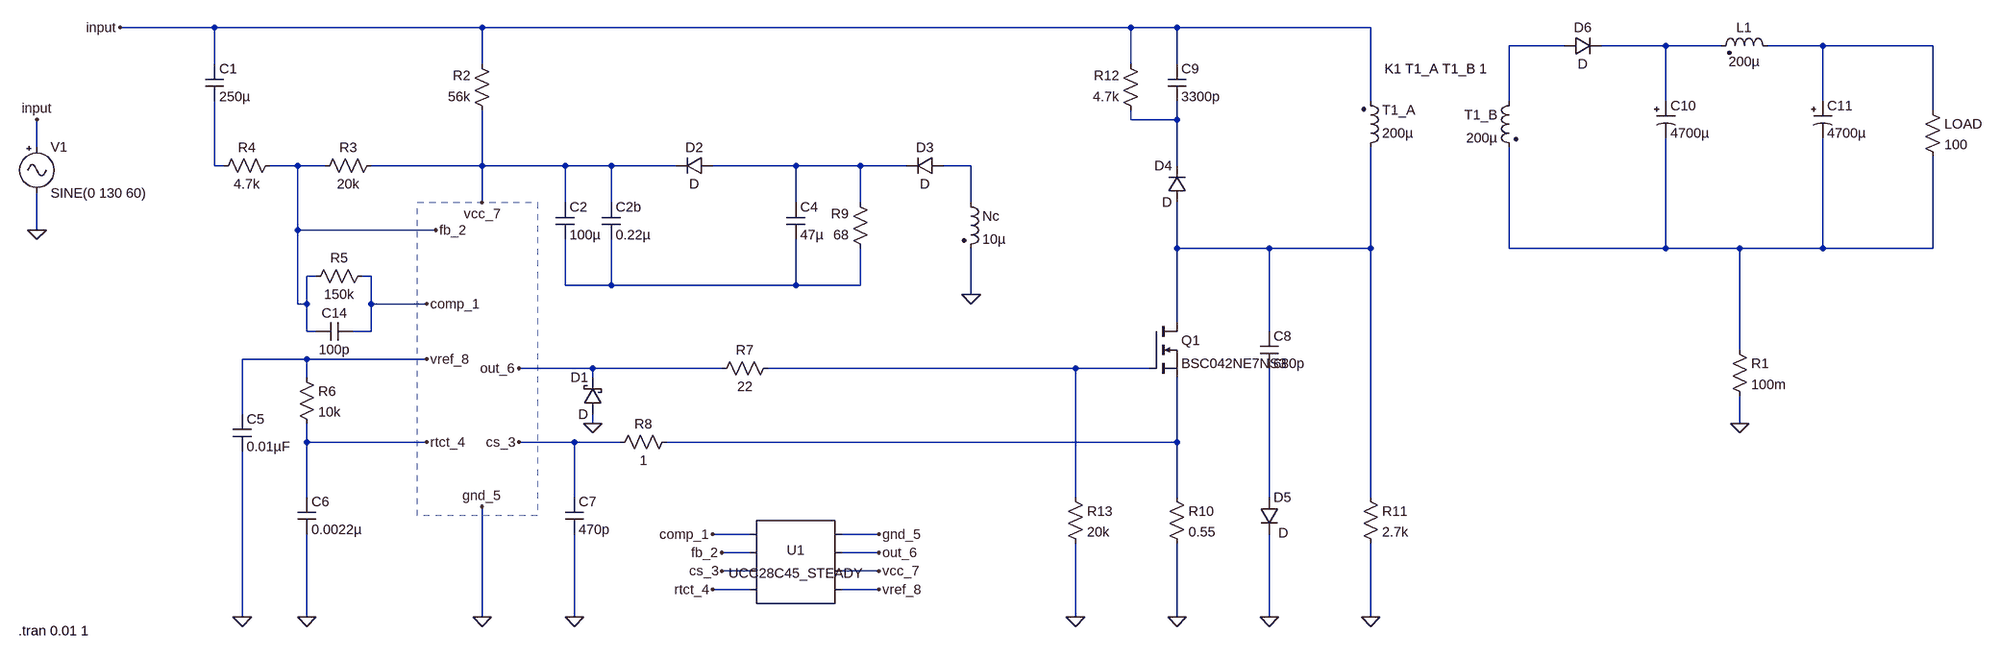
[diagram p0: schematic flyback_1.asc]
flyback_1.asc, the LTspice schematic file:
Version 4
SHEET 1 2808 956
WIRE -528 -304 -752 -304
WIRE -64 -304 -528 -304
WIRE 1216 -304 -64 -304
WIRE 1296 -304 1216 -304
WIRE 1632 -304 1296 -304
WIRE 1968 -272 1872 -272
WIRE 2144 -272 2032 -272
WIRE 2240 -272 2144 -272
WIRE 2416 -272 2320 -272
WIRE 2720 -272 2416 -272
WIRE -528 -240 -528 -304
WIRE -64 -240 -64 -304
WIRE 1216 -240 1216 -304
WIRE 1296 -240 1296 -304
WIRE 1632 -176 1632 -304
WIRE 1872 -176 1872 -272
WIRE 2144 -176 2144 -272
WIRE 2416 -176 2416 -272
WIRE 2720 -160 2720 -272
WIRE 1216 -144 1216 -160
WIRE 1296 -144 1296 -176
WIRE 1296 -144 1216 -144
WIRE -896 -96 -896 -144
WIRE -528 -64 -528 -176
WIRE -512 -64 -528 -64
WIRE -384 -64 -432 -64
WIRE -336 -64 -384 -64
WIRE -64 -64 -64 -160
WIRE -64 -64 -256 -64
WIRE 80 -64 -64 -64
WIRE 160 -64 80 -64
WIRE 272 -64 160 -64
WIRE 480 -64 336 -64
WIRE 592 -64 480 -64
WIRE 672 -64 592 -64
WIRE 784 -64 736 -64
WIRE 1296 -64 1296 -144
WIRE -64 0 -64 -64
WIRE 80 0 80 -64
WIRE 160 0 160 -64
WIRE 480 0 480 -64
WIRE 592 0 592 -64
WIRE 784 0 784 -64
WIRE -896 48 -896 -16
WIRE -384 48 -384 -64
WIRE -144 48 -384 48
WIRE 1296 80 1296 0
WIRE 1456 80 1296 80
WIRE 1632 80 1632 -96
WIRE 1632 80 1456 80
WIRE 1872 80 1872 -96
WIRE 2144 80 2144 -112
WIRE 2144 80 1872 80
WIRE 2272 80 2144 80
WIRE 2416 80 2416 -112
WIRE 2416 80 2272 80
WIRE 2720 80 2720 -80
WIRE 2720 80 2416 80
WIRE -352 128 -368 128
WIRE -256 128 -272 128
WIRE 80 144 80 64
WIRE 160 144 160 64
WIRE 160 144 80 144
WIRE 480 144 480 64
WIRE 480 144 160 144
WIRE 592 144 592 80
WIRE 592 144 480 144
WIRE 784 160 784 80
WIRE -384 176 -384 48
WIRE -368 176 -368 128
WIRE -368 176 -384 176
WIRE -256 176 -256 128
WIRE -160 176 -256 176
WIRE 1296 208 1296 80
WIRE -368 224 -368 176
WIRE -352 224 -368 224
WIRE -256 224 -256 176
WIRE -256 224 -288 224
WIRE 1456 224 1456 80
WIRE 2272 256 2272 80
WIRE -368 272 -480 272
WIRE -160 272 -368 272
WIRE 128 288 0 288
WIRE 352 288 128 288
WIRE 1120 288 432 288
WIRE 1248 288 1120 288
WIRE -368 304 -368 272
WIRE 128 304 128 288
WIRE -480 368 -480 272
WIRE 128 384 128 368
WIRE 2272 384 2272 336
WIRE -368 416 -368 384
WIRE -160 416 -368 416
WIRE 96 416 0 416
WIRE 176 416 96 416
WIRE 1296 416 1296 304
WIRE 1296 416 256 416
WIRE -368 512 -368 416
WIRE 96 512 96 416
WIRE 1120 512 1120 288
WIRE 1296 512 1296 416
WIRE 1456 512 1456 288
WIRE 1632 512 1632 80
WIRE 400 576 336 576
WIRE 624 576 560 576
WIRE 400 608 352 608
WIRE 624 608 560 608
WIRE 400 640 352 640
WIRE 624 640 560 640
WIRE 400 672 336 672
WIRE 624 672 560 672
WIRE -480 720 -480 432
WIRE -368 720 -368 576
WIRE -64 720 -64 528
WIRE 96 720 96 576
WIRE 1120 720 1120 592
WIRE 1296 720 1296 592
WIRE 1456 720 1456 576
WIRE 1632 720 1632 592
FLAG 336 576 comp_1
FLAG 352 608 fb_2
FLAG 352 640 cs_3
FLAG 336 672 rtct_4
FLAG 624 672 vref_8
FLAG 624 608 out_6
FLAG 624 640 vcc_7
FLAG 624 576 gnd_5
FLAG -160 176 comp_1
FLAG -144 48 fb_2
FLAG 0 416 cs_3
FLAG -160 416 rtct_4
FLAG -160 272 vref_8
FLAG 0 288 out_6
FLAG -64 0 vcc_7
FLAG -64 528 gnd_5
FLAG 784 160 0
FLAG -64 720 0
FLAG 96 720 0
FLAG -368 720 0
FLAG -480 720 0
FLAG 1296 720 0
FLAG 1120 720 0
FLAG 1456 720 0
FLAG 1632 720 0
FLAG -752 -304 input
FLAG 128 384 0
FLAG -896 48 0
FLAG -896 -144 input
FLAG 2272 384 0
SYMBOL AutoGenerated\\UCC28C45_STEADY 480 624 R0
SYMATTR InstName U1
SYMBOL cap -544 -240 R0
SYMATTR InstName C1
SYMATTR Value 250µ
SYMATTR SpiceLine V=250
SYMBOL cap 1280 -240 R0
SYMATTR InstName C9
SYMATTR Value 3300p
SYMATTR SpiceLine V=600
SYMBOL res -48 -144 R180
WINDOW 0 36 76 Left 2
WINDOW 3 36 40 Left 2
SYMATTR InstName R2
SYMATTR Value 56k
SYMBOL res 1232 -144 R180
WINDOW 0 36 76 Left 2
WINDOW 3 36 40 Left 2
SYMATTR InstName R12
SYMATTR Value 4.7k
SYMATTR SpiceLine pwr=2
SYMBOL diode 1312 0 R180
WINDOW 0 24 64 Left 2
WINDOW 3 24 0 Left 2
SYMATTR InstName D4
SYMBOL res -240 -80 R90
WINDOW 0 0 56 VBottom 2
WINDOW 3 32 56 VTop 2
SYMATTR InstName R3
SYMATTR Value 20k
SYMBOL res -416 -80 R90
WINDOW 0 0 56 VBottom 2
WINDOW 3 32 56 VTop 2
SYMATTR InstName R4
SYMATTR Value 4.7k
SYMBOL res -256 112 R90
WINDOW 0 0 56 VBottom 2
WINDOW 3 32 56 VTop 2
SYMATTR InstName R5
SYMATTR Value 150k
SYMBOL cap -288 208 R90
WINDOW 0 0 32 VBottom 2
WINDOW 3 32 32 VTop 2
SYMATTR InstName C14
SYMATTR Value 100p
SYMBOL cap -384 512 R0
SYMATTR InstName C6
SYMATTR Value 0.0022µ
SYMBOL cap 464 0 R0
SYMATTR InstName C4
SYMATTR Value 47µ
SYMATTR SpiceLine V=25
SYMBOL cap 144 0 R0
SYMATTR InstName C2b
SYMATTR Value 0.22µ
SYMBOL cap 64 0 R0
SYMATTR InstName C2
SYMATTR Value 100µ
SYMATTR SpiceLine V=25
SYMBOL diode 336 -48 M270
WINDOW 0 32 32 VTop 2
WINDOW 3 0 32 VBottom 2
SYMATTR InstName D2
SYMBOL diode 736 -80 R90
WINDOW 0 0 32 VBottom 2
WINDOW 3 32 32 VTop 2
SYMATTR InstName D3
SYMBOL res 608 96 R180
WINDOW 0 36 76 Left 2
WINDOW 3 36 40 Left 2
SYMATTR InstName R9
SYMATTR Value 68
SYMATTR SpiceLine pwr=3
SYMBOL ind2 768 -16 R0
SYMATTR InstName Nc
SYMATTR Value 10µ
SYMBOL res -384 288 R0
SYMATTR InstName R6
SYMATTR Value 10k
SYMBOL cap -496 368 R0
SYMATTR InstName C5
SYMATTR Value 0.01µF
SYMBOL res 448 272 R90
WINDOW 0 0 56 VBottom 2
WINDOW 3 32 56 VTop 2
SYMATTR InstName R7
SYMATTR Value 22
SYMBOL nmos 1248 208 R0
SYMATTR InstName Q1
SYMATTR Value BSC042NE7NS3
SYMBOL res 272 400 R90
WINDOW 0 0 56 VBottom 2
WINDOW 3 32 56 VTop 2
SYMATTR InstName R8
SYMATTR Value 1
SYMBOL cap 80 512 R0
SYMATTR InstName C7
SYMATTR Value 470p
SYMBOL ind2 1616 -80 M180
WINDOW 0 36 80 Left 2
WINDOW 3 36 40 Left 2
SYMATTR InstName T1_A
SYMATTR Value 200µ
SYMBOL res 1280 496 R0
SYMATTR InstName R10
SYMATTR Value 0.55
SYMATTR SpiceLine pwr=1
SYMBOL res 1104 496 R0
SYMATTR InstName R13
SYMATTR Value 20k
SYMBOL cap 1440 224 R0
SYMATTR InstName C8
SYMATTR Value 680p
SYMBOL res 1616 496 R0
SYMATTR InstName R11
SYMATTR Value 2.7k
SYMATTR SpiceLine pwr=2
SYMBOL diode 1440 512 R0
WINDOW 3 32 62 Left 2
SYMATTR InstName D5
SYMBOL schottky 144 368 R180
WINDOW 0 24 64 Left 2
WINDOW 3 24 0 Left 2
SYMATTR InstName D1
SYMBOL ind2 1888 -192 M0
SYMATTR InstName T1_B
SYMATTR Value 200µ
SYMBOL diode 1968 -256 R270
WINDOW 0 32 32 VTop 2
WINDOW 3 0 32 VBottom 2
SYMATTR InstName D6
SYMBOL polcap 2128 -176 R0
SYMATTR InstName C10
SYMATTR Value 4700µ
SYMATTR SpiceLine V=10
SYMBOL polcap 2400 -176 R0
SYMATTR InstName C11
SYMATTR Value 4700µ
SYMBOL ind2 2336 -256 M270
WINDOW 0 32 56 VTop 2
WINDOW 3 4 56 VBottom 2
SYMATTR InstName L1
SYMATTR Value 200µ
SYMBOL Misc\\signal -896 -112 R0
WINDOW 123 0 0 Left 0
WINDOW 39 0 0 Left 0
SYMATTR InstName V1
SYMATTR Value SINE(0 130 60)
SYMBOL res 2704 -176 R0
SYMATTR InstName LOAD
SYMATTR Value 100
SYMBOL res 2256 240 R0
SYMATTR InstName R1
SYMATTR Value 100m
TEXT 1656 -232 Left 2 !K1 T1_A T1_B 1
TEXT -928 744 Left 2 !.tran 0.01 1
RECTANGLE Normal 32 544 -176 0 2

The netlist it stands for:
* flyback_1.asc
* U1: UCC28C45_STEADY (symbol AutoGenerated\UCC28C45_STEADY not available, pins judged from their places): pin1=comp_1 pin2=fb_2 pin3=cs_3 pin4=rtct_4 pin5=0 pin6=out_6 pin7=vcc_7 pin8=vref_8
C1 input N005 250µ V=250
C9 input N004 3300p V=600
R2 vcc_7 input 56k
R12 N004 input 4.7k pwr=2
D4 N008 N004 D
R3 vcc_7 fb_2 20k
R4 fb_2 N005 4.7k
R5 comp_1 fb_2 150k
C14 comp_1 fb_2 100p
C6 rtct_4 0 0.0022µ
C4 N006 N010 47µ V=25
C2b vcc_7 N010 0.22µ
C2 vcc_7 N010 100µ V=25
D2 N006 vcc_7 D
D3 N007 N006 D
R9 N010 N006 68 pwr=3
L§Nc N007 0 10µ
R6 vref_8 rtct_4 10k
C5 vref_8 0 0.01µF
R7 N011 out_6 22
M§Q1 N008 N011 N012 N012 BSC042NE7NS3
R8 N012 cs_3 1
C7 cs_3 0 470p
L§T1_A N008 input 200µ
R10 N012 0 0.55 pwr=1
R13 N011 0 20k
C8 N008 N013 680p
R11 N008 0 2.7k pwr=2
D5 N013 0 D
D1 0 out_6 D
L§T1_B N001 N009 200µ
D6 N001 N002 D
C10 N002 N009 4700µ V=10
C11 N003 N009 4700µ
L1 N003 N002 200µ
V1 input 0 SINE(0 130 60)
R§LOAD N003 N009 100
R1 N009 0 100m
.model D D
.lib standard.dio
.model NMOS NMOS
.model PMOS PMOS
.lib standard.mos
K1 T1_A T1_B 1
.tran 0.01 1
.backanno
.end